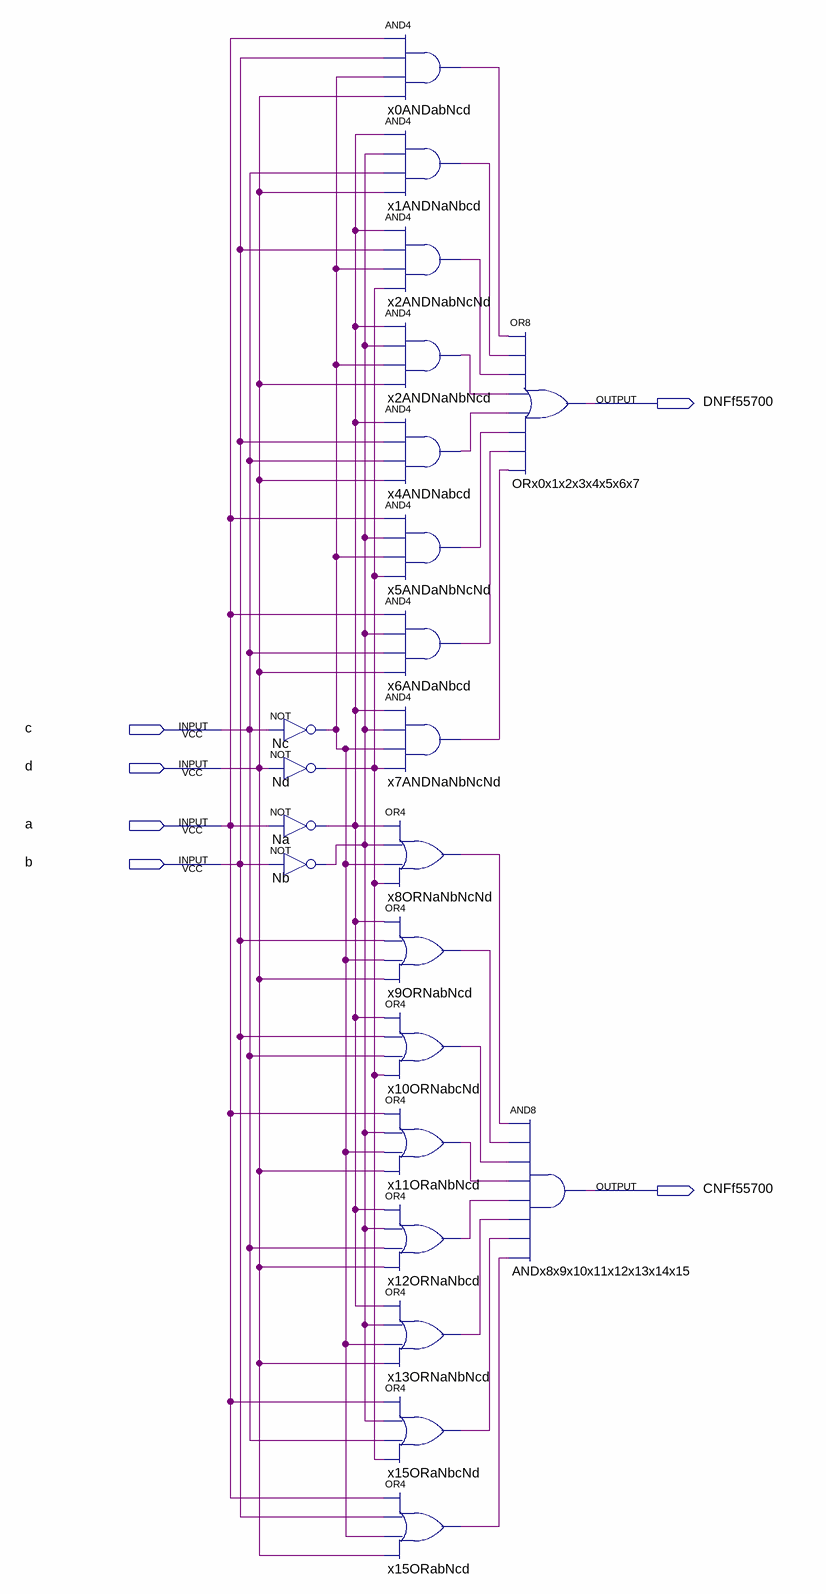
[diagram p0: schematic sheet]
// Quartus schematic Lab2.bdf as structural Verilog: 22 symbols, 6 pins
module Lab2 (
  input  c,
  input  d,
  input  a,
  input  b,
  output DNFf55700,
  output CNFf55700
);

  wire Na_out, Nb_out, Nc_out, Nd_out, x0ANDabNcd_out, x1ANDNaNbcd_out, x2ANDNabNcNd_out, x2ANDNaNbNcd_out,
       x4ANDNabcd_out, x5ANDaNbNcNd_out, x6ANDaNbcd_out, x7ANDNaNbNcNd_out, x8ORNaNbNcNd_out, x9ORNabNcd_out,
       x10ORNabcNd_out, x11ORaNbNcd_out, x12ORNaNbcd_out, x13ORNaNbNcd_out, x15ORabNcd_out, x15ORaNbcNd_out;

  not Nc (Nc_out, c);
  not Nd (Nd_out, d);
  not Na (Na_out, a);
  not Nb (Nb_out, b);
  and x0ANDabNcd (x0ANDabNcd_out, a, b, Nc_out, d);
  and x1ANDNaNbcd (x1ANDNaNbcd_out, Na_out, Nb_out, c, d);
  and x2ANDNabNcNd (x2ANDNabNcNd_out, Na_out, b, Nc_out, Nd_out);
  and x2ANDNaNbNcd (x2ANDNaNbNcd_out, Na_out, Nb_out, Nc_out, d);
  and x4ANDNabcd (x4ANDNabcd_out, Na_out, b, c, d);
  and x5ANDaNbNcNd (x5ANDaNbNcNd_out, a, Nb_out, Nc_out, Nd_out);
  and x6ANDaNbcd (x6ANDaNbcd_out, a, Nb_out, c, d);
  and x7ANDNaNbNcNd (x7ANDNaNbNcNd_out, Na_out, Nb_out, Nc_out, Nd_out);
  or x8ORNaNbNcNd (x8ORNaNbNcNd_out, Na_out, Nb_out, Nc_out, Nd_out);
  or x9ORNabNcd (x9ORNabNcd_out, Na_out, b, Nc_out, d);
  or x10ORNabcNd (x10ORNabcNd_out, Na_out, b, c, Nd_out);
  or x11ORaNbNcd (x11ORaNbNcd_out, a, Nb_out, Nc_out, d);
  or x12ORNaNbcd (x12ORNaNbcd_out, Na_out, Nb_out, c, d);
  or x13ORNaNbNcd (x13ORNaNbNcd_out, Na_out, Nb_out, Nc_out, d);
  or x15ORaNbcNd (x15ORaNbcNd_out, a, Nb_out, c, Nd_out);
  or x15ORabNcd (x15ORabNcd_out, a, b, Nc_out, d);
  or ORx0x1x2x3x4x5x6x7 (DNFf55700, x0ANDabNcd_out, x1ANDNaNbcd_out, x2ANDNabNcNd_out, x2ANDNaNbNcd_out, x4ANDNabcd_out, x5ANDaNbNcNd_out, x6ANDaNbcd_out, x7ANDNaNbNcNd_out);
  and ANDx8x9x10x11x12x13x14x15 (CNFf55700, x8ORNaNbNcNd_out, x9ORNabNcd_out, x10ORNabcNd_out, x11ORaNbNcd_out, x12ORNaNbcd_out, x13ORNaNbNcd_out, x15ORaNbcNd_out, x15ORabNcd_out);
endmodule
